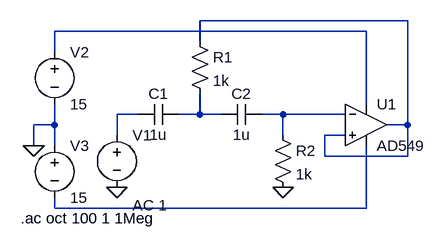
[diagram p0: schematic HighPassFilter2.asc]
HighPassFilter2.asc, the LTspice schematic file:
Version 4
SHEET 1 880 680
WIRE 672 -32 352 -32
WIRE 608 -16 128 -16
WIRE 352 0 352 -32
WIRE 128 16 128 -16
WIRE 608 96 608 -16
WIRE 256 112 224 112
WIRE 352 112 352 80
WIRE 352 112 320 112
WIRE 384 112 352 112
WIRE 480 112 448 112
WIRE 576 112 480 112
WIRE 128 128 128 96
WIRE 128 128 96 128
WIRE 672 128 672 -32
WIRE 672 128 640 128
WIRE 224 144 224 112
WIRE 480 144 480 112
WIRE 576 144 544 144
WIRE 96 160 96 128
WIRE 128 160 128 128
WIRE 544 176 544 144
WIRE 672 176 672 128
WIRE 672 176 544 176
WIRE 128 256 128 240
WIRE 608 256 608 160
WIRE 608 256 128 256
FLAG 480 224 0
FLAG 224 224 0
FLAG 96 160 0
SYMBOL voltage 224 128 R0
WINDOW 123 24 124 Left 2
WINDOW 39 0 0 Left 0
SYMATTR InstName V1
SYMATTR Value ""
SYMATTR Value2 AC 1
SYMBOL voltage 128 0 R0
WINDOW 123 0 0 Left 0
WINDOW 39 0 0 Left 0
SYMATTR InstName V2
SYMATTR Value 15
SYMBOL voltage 128 144 R0
WINDOW 123 0 0 Left 0
WINDOW 39 0 0 Left 0
SYMATTR InstName V3
SYMATTR Value 15
SYMBOL cap 320 96 R90
WINDOW 0 0 32 VBottom 2
WINDOW 3 32 32 VTop 2
SYMATTR InstName C1
SYMATTR Value 1u
SYMBOL cap 448 96 R90
WINDOW 0 0 32 VBottom 2
WINDOW 3 32 32 VTop 2
SYMATTR InstName C2
SYMATTR Value 1u
SYMBOL res 336 -16 R0
SYMATTR InstName R1
SYMATTR Value 1k
SYMBOL res 464 128 R0
SYMATTR InstName R2
SYMATTR Value 1k
SYMBOL Opamps\\AD549 608 64 R0
SYMATTR InstName U1
TEXT 76 272 Left 2 !.ac oct 100 1 1Meg

The netlist it stands for:
* HighPassFilter2.asc
V1 N003 0 AC 1
V2 N002 0 15
V3 0 N006 15
C1 N004 N003 1u
C2 N005 N004 1u
R1 N001 N004 1k
R2 N005 0 1k
XU1 N001 N005 N002 N006 N001 AD549  ; pins In+ In- V+ V- OUT
.ac oct 100 1 1Meg
.backanno
.end